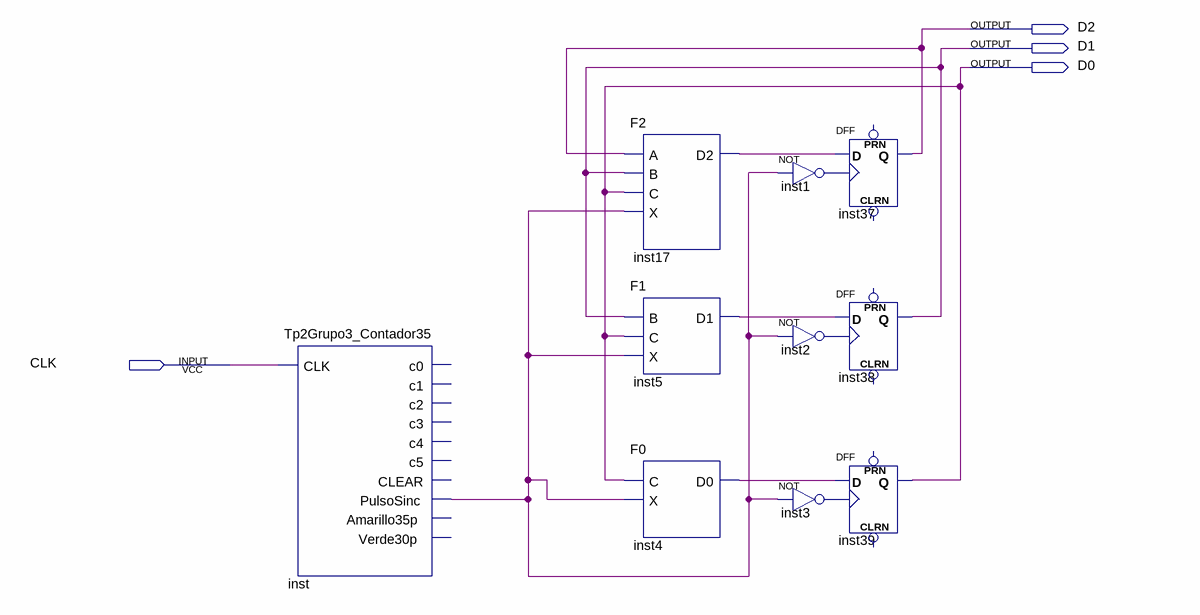
[diagram p0: schematic sheet]
// Quartus schematic MaquinaDeEstado.bdf as structural Verilog: 10 symbols, 4 pins
module MaquinaDeEstado (
  input  CLK,
  output D2,
  output D1,
  output D0
);

  wire inst1_out, inst2_out, inst3_out, inst4_d0, inst5_d1, inst17_d2, inst_pulsosinc;

  Tp2Grupo3_Contador35 inst (
    .CLK(CLK), .PulsoSinc(inst_pulsosinc));  // open: c0, c1, c2, c3, c4, c5, CLEAR, Amarillo35p, Verde30p
  F2 inst17 (.A(D2), .B(D1), .C(D0), .X(inst_pulsosinc), .D2(inst17_d2));
  F1 inst5 (.B(D1), .C(D0), .X(inst_pulsosinc), .D1(inst5_d1));
  F0 inst4 (.C(D0), .X(inst_pulsosinc), .D0(inst4_d0));
  not inst1 (inst1_out, inst_pulsosinc);
  not inst2 (inst2_out, inst_pulsosinc);
  not inst3 (inst3_out, inst_pulsosinc);
  DFF inst37 (.CLK(inst1_out), .D(inst17_d2), .Q(D2));  // open: CLRN, PRN
  DFF inst38 (.CLK(inst2_out), .D(inst5_d1), .Q(D1));  // open: CLRN, PRN
  DFF inst39 (.CLK(inst3_out), .D(inst4_d0), .Q(D0));  // open: CLRN, PRN
endmodule
